# Altium project PCB_MCU.PrjPcb
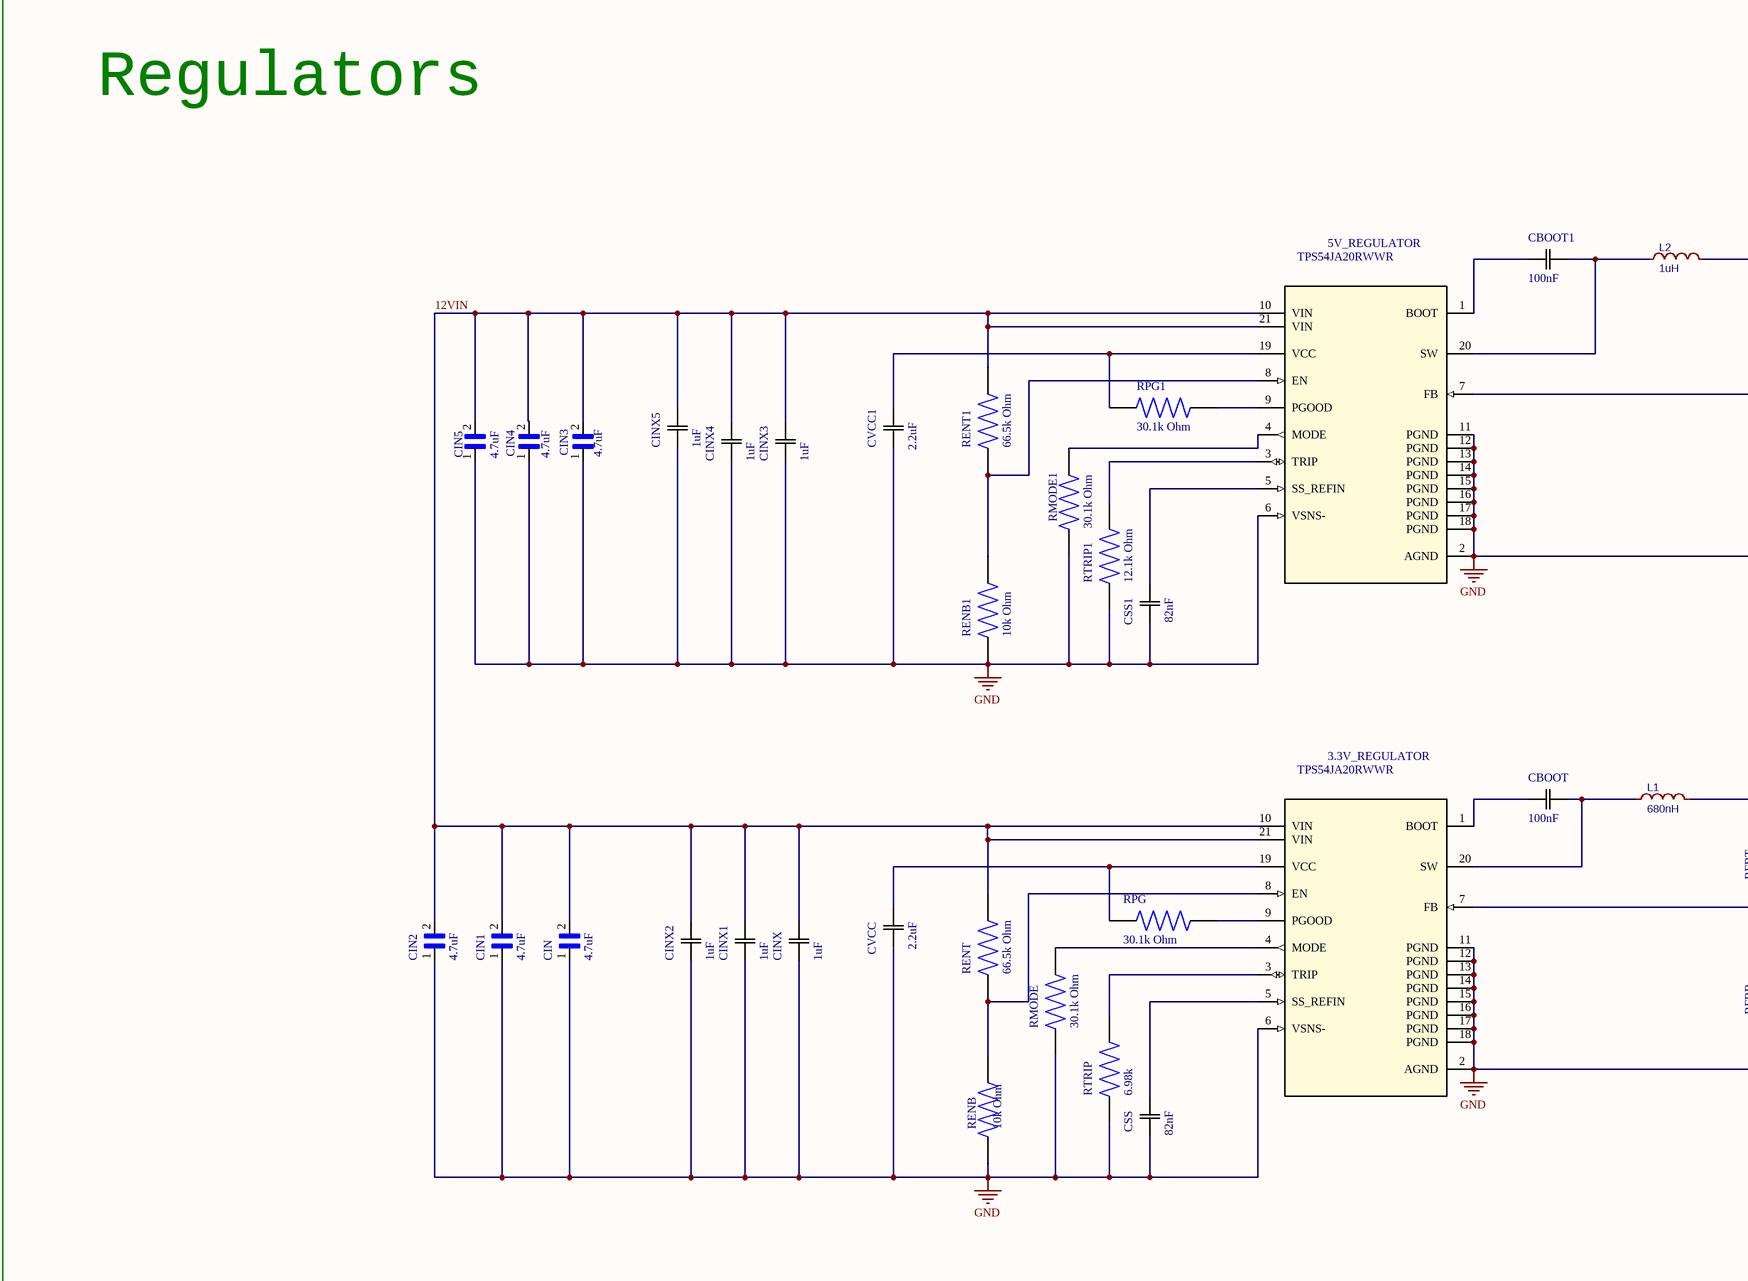
[diagram p0: PCB_MCU.SchDoc, top column 1 of 4]
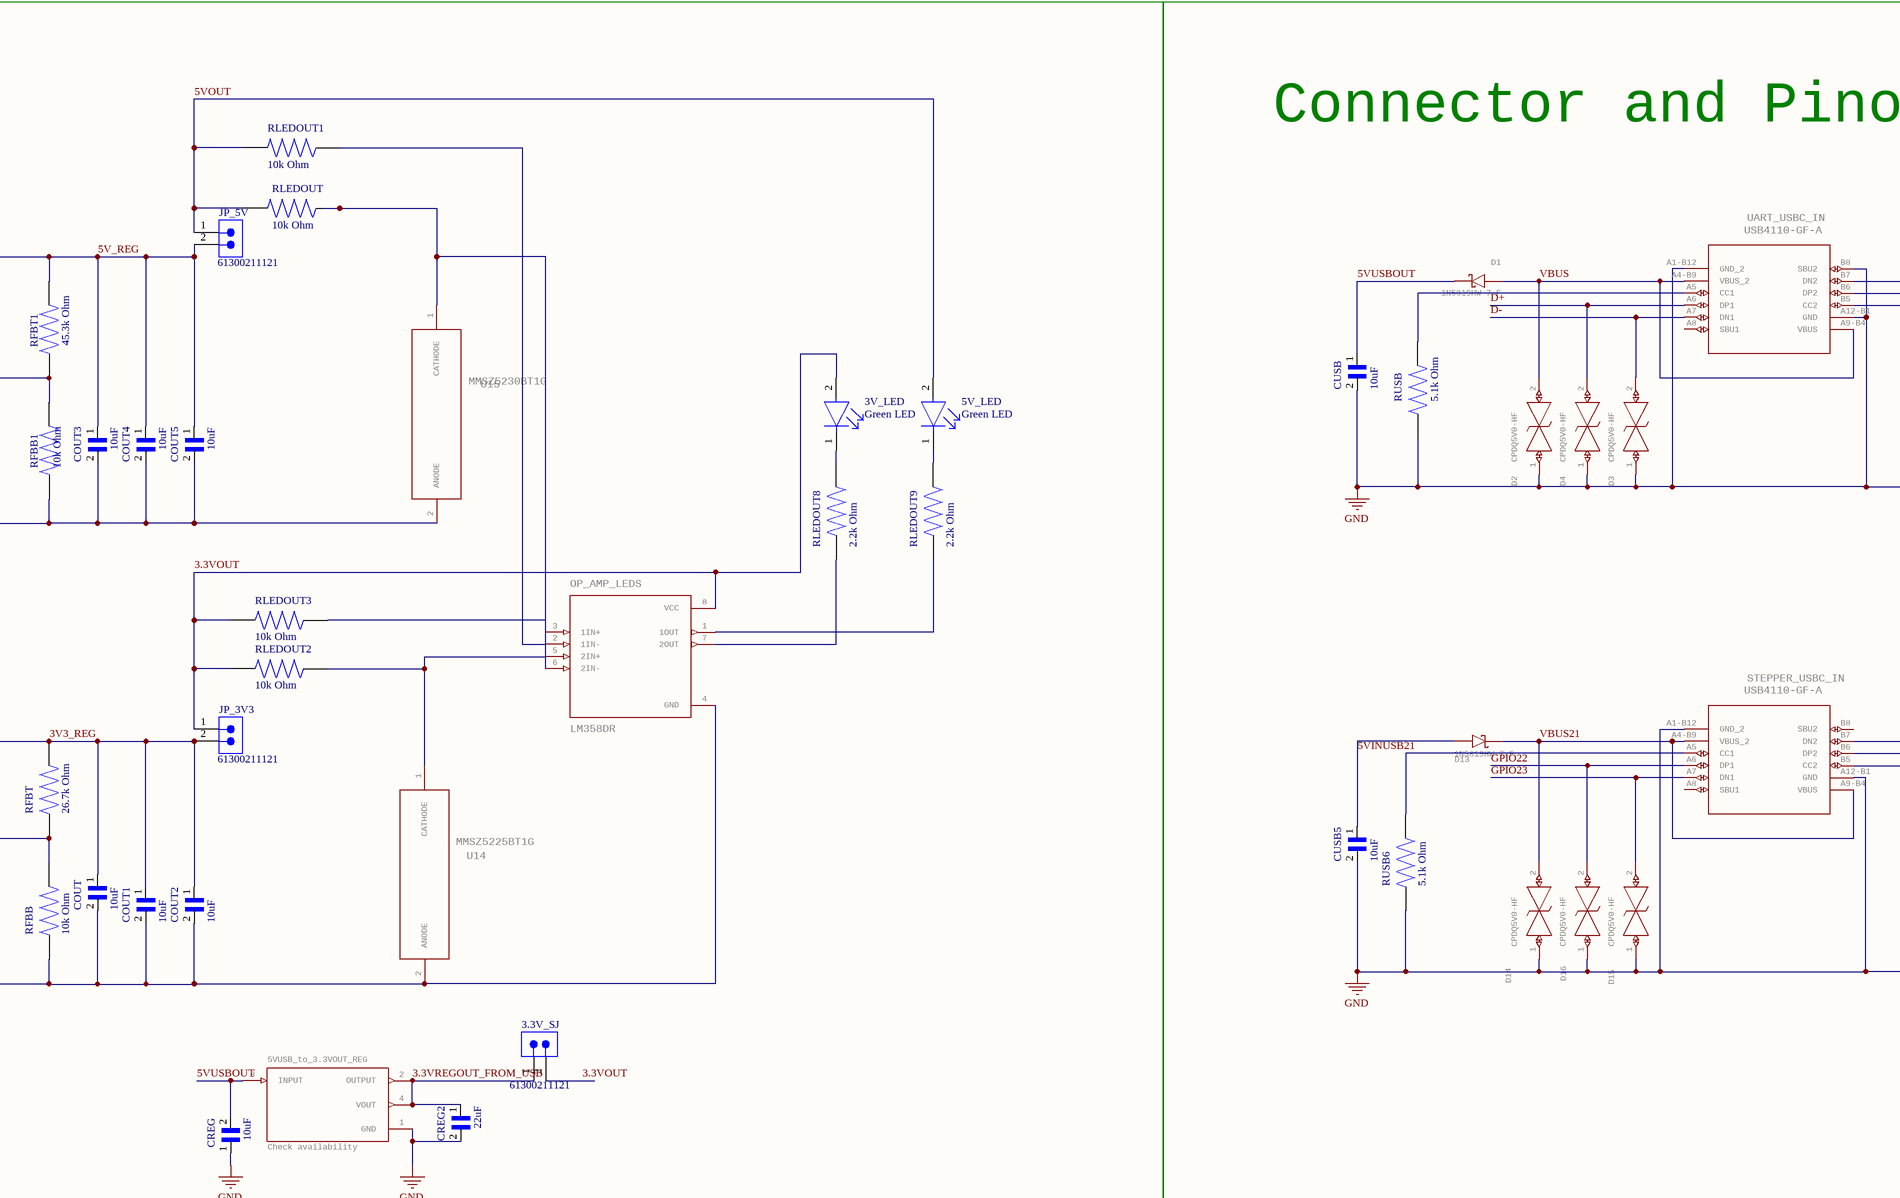
[diagram p1: PCB_MCU.SchDoc, top column 2 of 4]
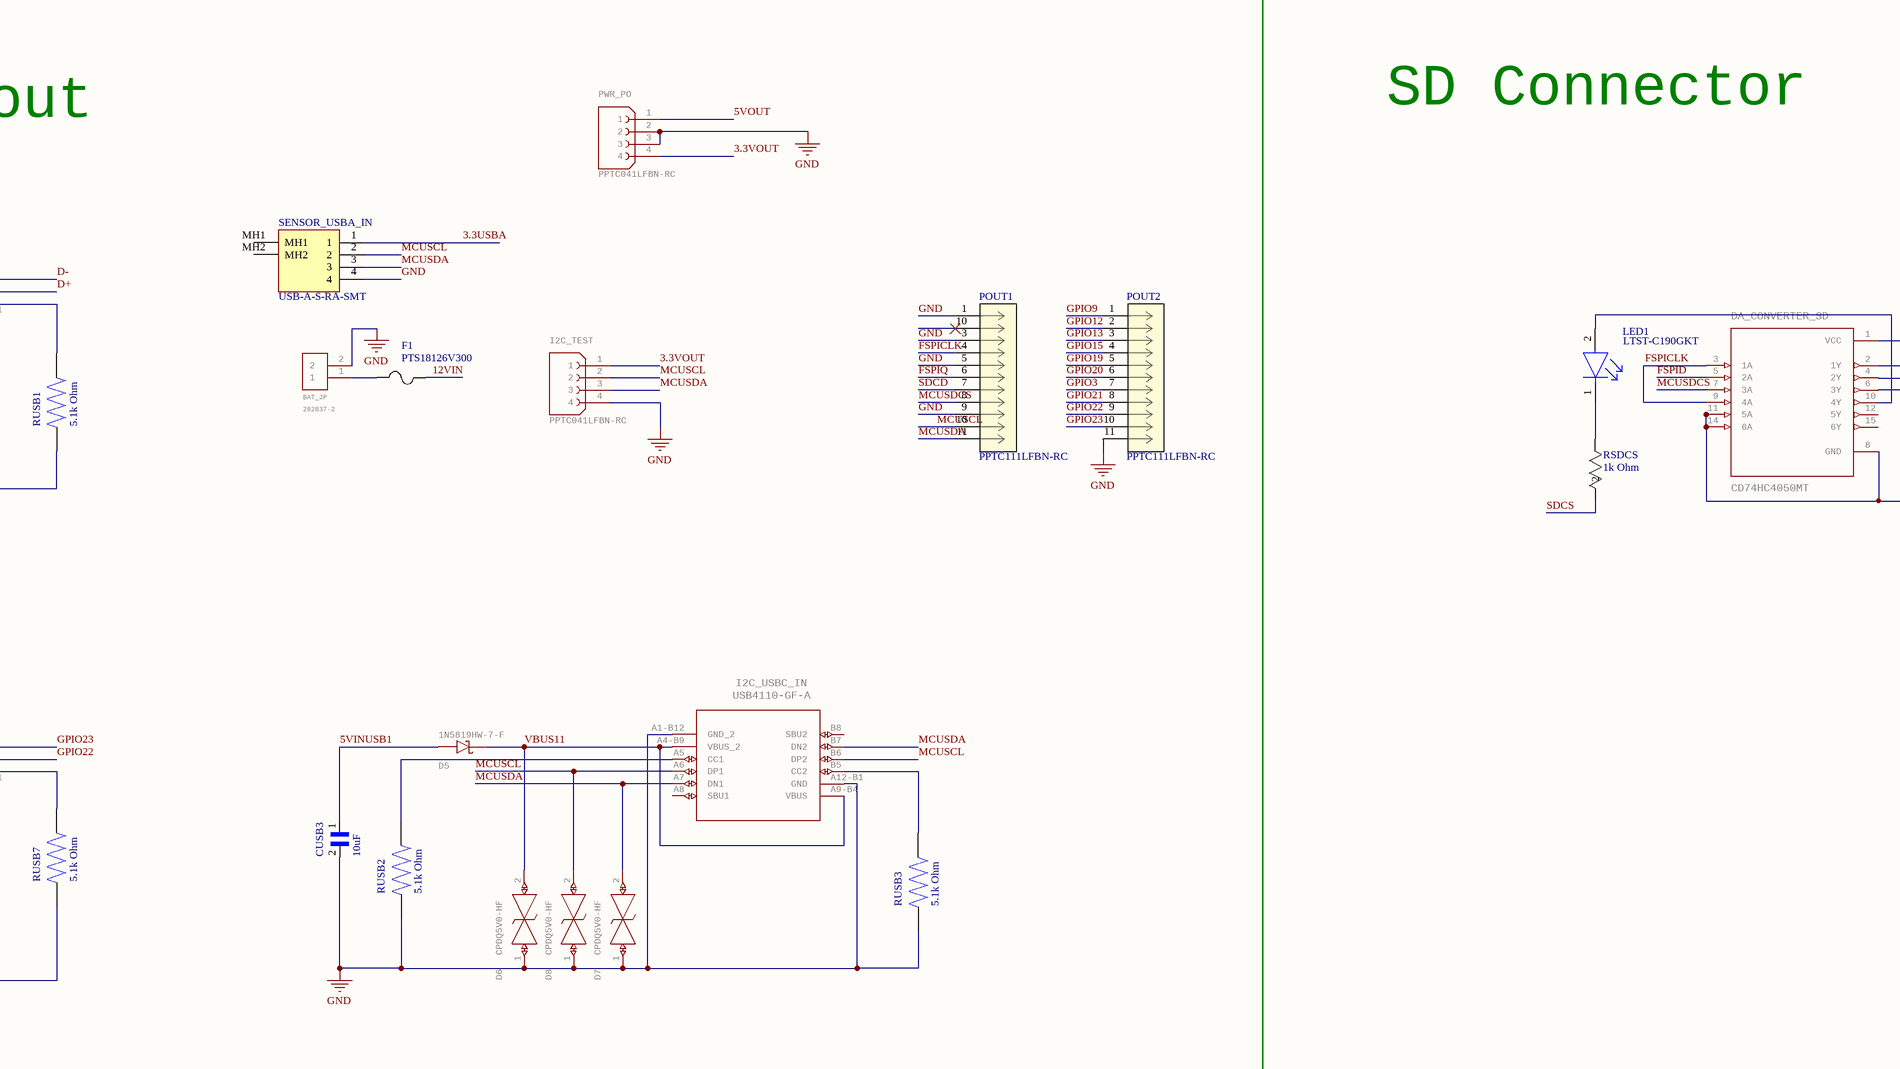
[diagram p2: PCB_MCU.SchDoc, top column 3 of 4]
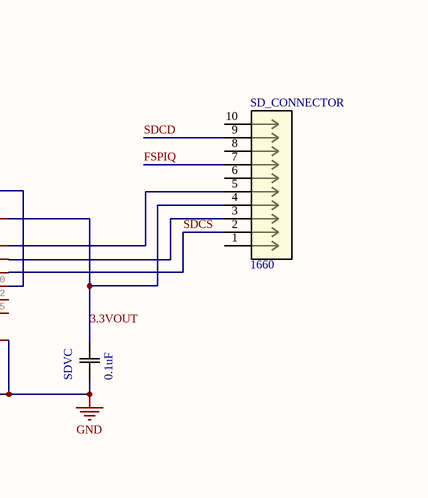
[diagram p3: PCB_MCU.SchDoc, top column 4 of 4]
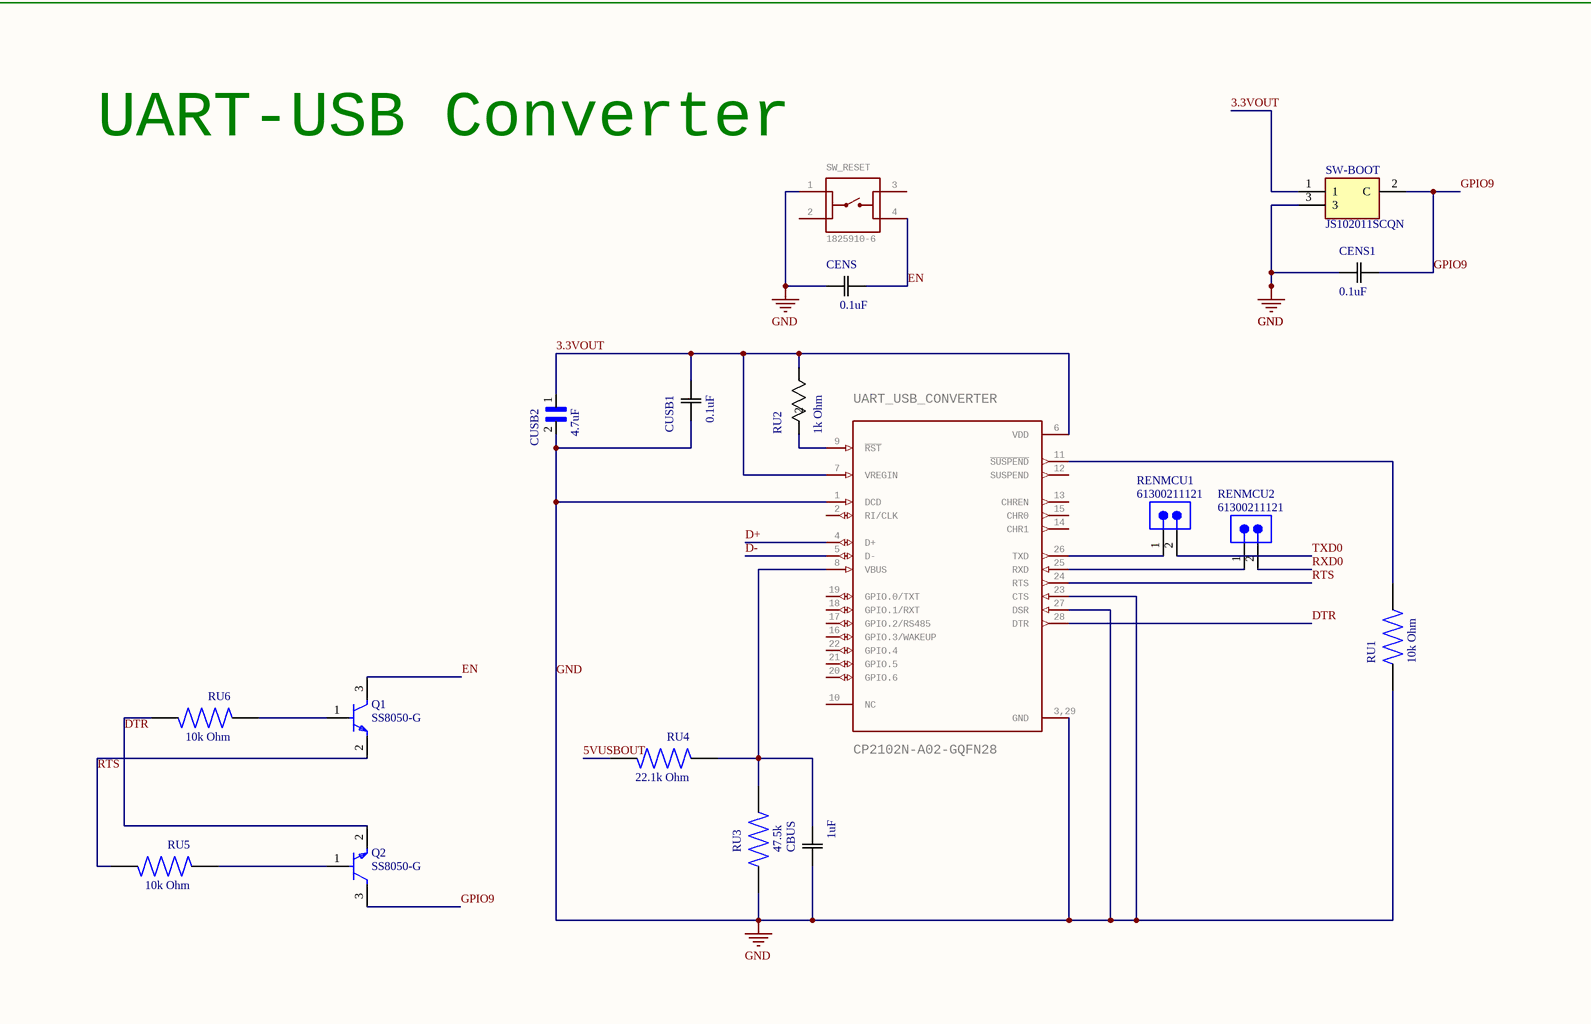
[diagram p4: PCB_MCU.SchDoc, bottom column 1 of 4]
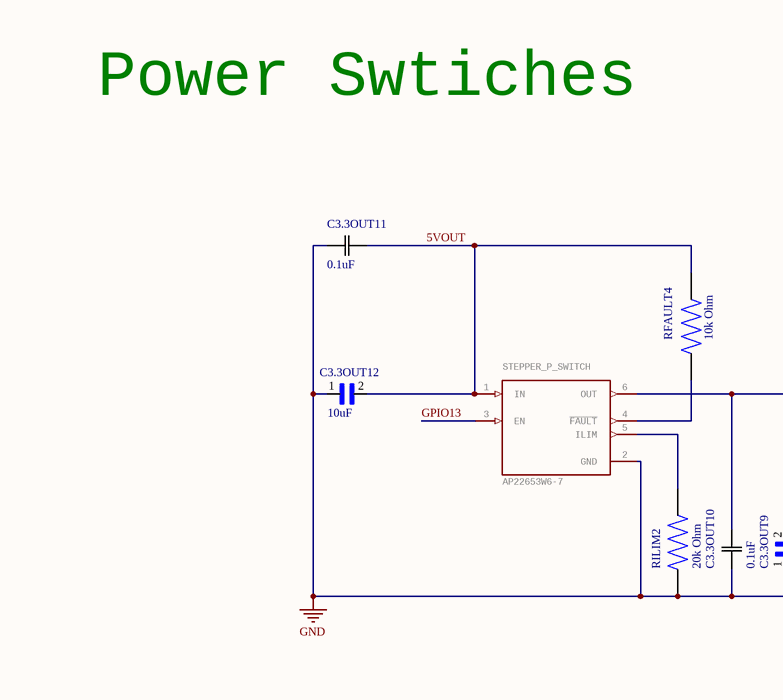
[diagram p5: PCB_MCU.SchDoc, bottom column 2 of 4]
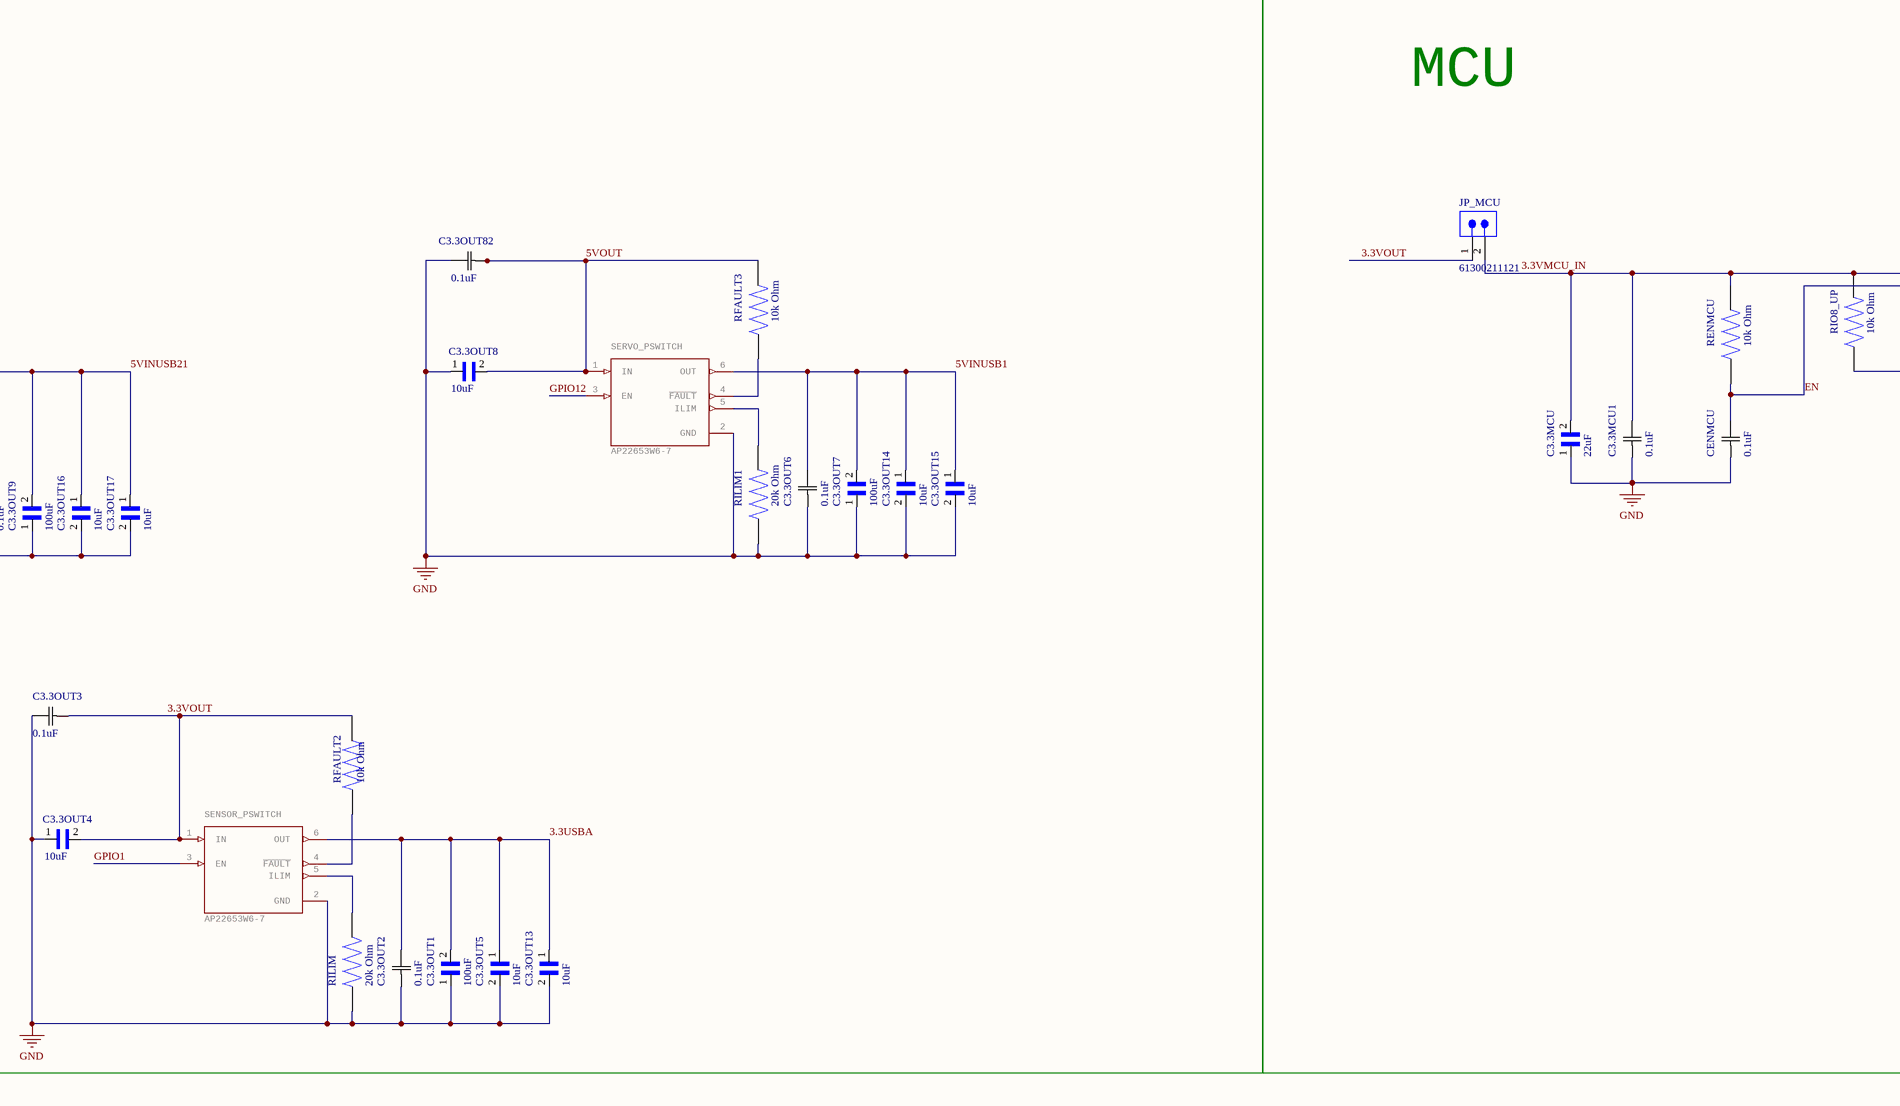
[diagram p6: PCB_MCU.SchDoc, bottom column 3 of 4]
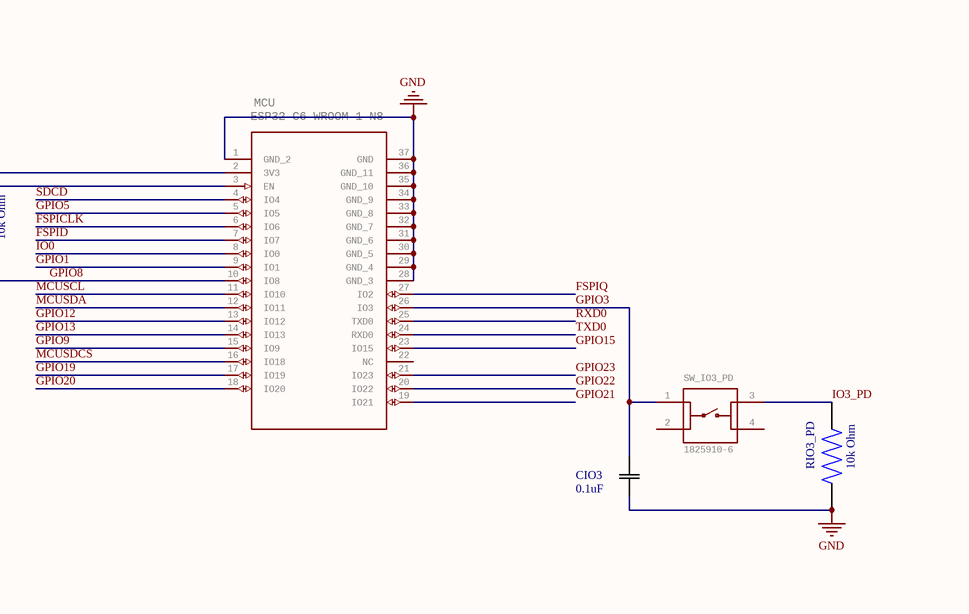
[diagram p7: PCB_MCU.SchDoc, bottom column 4 of 4]
1 sheet, 150 parts. Net scope: global (net labels, ports and power ports of the same name join across sheets).
Board file: PCB_MCU.PcbDoc

## Sheet PCB_MCU.SchDoc
size 1424 x 515 mm; Origin: Eagle

### Parts
3.3V_REGULATOR  TPS54JA20RWWR  [RWW0021A]
3.3V_SJ  61300211121  [61300211121]
3V_LED  Green LED  [FP-LTST-C190GKT-MFG]
5V_LED  Green LED  [FP-LTST-C190GKT-MFG]
5V_REGULATOR  TPS54JA20RWWR  [RWW0021A]
5VUSB_to_3.3VOUT_REG  Check availability  [SOT230P700X185-4N]
BAT_JP  282837-2  [TE_282837-2]
C3.3MCU  22uF  [CAPC2012X145N]
C3.3MCU1  0.1uF  [CAP_KGM21_KAV]
C3.3OUT1  100uF  [CAPC2012X145N]
C3.3OUT2  0.1uF  [CAP_KGM21_KAV]
C3.3OUT3  0.1uF  [CAP_KGM21_KAV]
C3.3OUT4  10uF  [CAPC2012X88N]
C3.3OUT5  10uF  [CAPC2012X88N]
C3.3OUT6  0.1uF  [CAP_KGM21_KAV]
C3.3OUT7  100uF  [CAPC2012X145N]
C3.3OUT8  10uF  [CAPC2012X88N]
C3.3OUT9  100uF  [CAPC2012X145N]
C3.3OUT10  0.1uF  [CAP_KGM21_KAV]
C3.3OUT11  0.1uF  [CAP_KGM21_KAV]
C3.3OUT12  10uF  [CAPC2012X88N]
C3.3OUT13  10uF  [CAPC2012X88N]
C3.3OUT14  10uF  [CAPC2012X88N]
C3.3OUT15  10uF  [CAPC2012X88N]
C3.3OUT16  10uF  [CAPC2012X88N]
C3.3OUT17  10uF  [CAPC2012X88N]
C3.3OUT82  0.1uF  [CAP_KGM21_KAV]
CBOOT  100nF  [CAPC230155_120N_KEM]
CBOOT1  100nF  [CAPC230155_120N_KEM]
CBUS  1uF  [CAPC230145_140N_KEM]
CENMCU  0.1uF  [CAP_KGM21_KAV]
CENS  0.1uF  [CAP_KGM21_KAV]
CENS1  0.1uF  [CAP_KGM21_KAV]
CIN  4.7uF  [CAPC2012X140N]
CIN1  4.7uF  [CAPC2012X140N]
CIN2  4.7uF  [CAPC2012X140N]
CIN3  4.7uF  [CAPC2012X140N]
CIN4  4.7uF  [CAPC2012X140N]
CIN5  4.7uF  [CAPC2012X140N]
CINX  1uF  [CAPC230145_140N_KEM]
CINX1  1uF  [CAPC230145_140N_KEM]
CINX2  1uF  [CAPC230145_140N_KEM]
CINX3  1uF  [CAPC230145_140N_KEM]
CINX4  1uF  [CAPC230145_140N_KEM]
CINX5  1uF  [CAPC230145_140N_KEM]
CIO3  0.1uF  [CAP_KGM21_KAV]
COUT  10uF  [CAPC2012X88N]
COUT1  10uF  [CAPC2012X88N]
COUT2  10uF  [CAPC2012X88N]
COUT3  10uF  [CAPC2012X88N]
COUT4  10uF  [CAPC2012X88N]
COUT5  10uF  [CAPC2012X88N]
CREG  10uF  [CAPC2012X88N]
CREG2  22uF  [CAPC2012X145N]
CSS  82nF  [CAP_CC0805_YAG]
CSS1  82nF  [CAP_CC0805_YAG]
CUSB  10uF  [CAPC2012X88N]
CUSB1  0.1uF  [CAP_KGM21_KAV]
CUSB2  4.7uF  [CAPC2012X140N]
CUSB3  10uF  [CAPC2012X88N]
CUSB5  10uF  [CAPC2012X88N]
CVCC  2.2uF  [CAPC220145_140N_KEM]
CVCC1  2.2uF  [CAPC220145_140N_KEM]
D1  1N5819HW-7-F  [SOD3715X145N]
D2  CPDQ5V0-HF  [MBTB-D-SOD-923F-IMP-0402]
D3  CPDQ5V0-HF  [MBTB-D-SOD-923F-IMP-0402]
D4  CPDQ5V0-HF  [MBTB-D-SOD-923F-IMP-0402]
D5  1N5819HW-7-F  [SOD3715X145N]
D6  CPDQ5V0-HF  [MBTB-D-SOD-923F-IMP-0402]
D7  CPDQ5V0-HF  [MBTB-D-SOD-923F-IMP-0402]
D8  CPDQ5V0-HF  [MBTB-D-SOD-923F-IMP-0402]
D13  1N5819HW-7-F  [SOD3715X145N]
D14  CPDQ5V0-HF  [MBTB-D-SOD-923F-IMP-0402]
D15  CPDQ5V0-HF  [MBTB-D-SOD-923F-IMP-0402]
D16  CPDQ5V0-HF  [MBTB-D-SOD-923F-IMP-0402]
DA_CONVERTER_SD  CD74HC4050MT  [SOIC127P600X175-16N]
F1  PTS18126V300  [FUSE_PTS18126_COB]
I2C_TEST  PPTC041LFBN-RC  [SULLINS_PPTC041LFBN-RC]
I2C_USBC_IN  USB4110-GF-A  [USB4110-GF-A_GCT]
JP_3V3  61300211121  [61300211121]
JP_5V  61300211121  [61300211121]
JP_MCU  61300211121  [61300211121]
L1  680nH  [IND-SMD_L11.3-W10.2_HPPC10024]
L2  1uH  [IND-SMD_L14.5-W13.5]
LED1  LTST-C190GKT  [FP-LTST-C190GKT-MFG]
MCU  ESP32-C6-WROOM-1-N8  [MOD28_ESP32-C6-WROOM-1_EXP]
OP_AMP_LEDS  LM358DR  [SOIC127P599X175-8N]
POUT1  PPTC111LFBN-RC  [CONN11_PPPN111_SUL]
POUT2  PPTC111LFBN-RC  [CONN11_PPPN111_SUL]
PWR_PO  PPTC041LFBN-RC  [SULLINS_PPTC041LFBN-RC]
Q1  SS8050-G  [FP-SS8050-G-MFG]
Q2  SS8050-G  [FP-SS8050-G-MFG]
RENB  10k Ohm  [RESC2012X55N]
RENB1  10k Ohm  [RESC2012X55N]
RENMCU  10k Ohm  [RESC2012X55N]
RENMCU1  61300211121  [61300211121]
RENMCU2  61300211121  [61300211121]
RENT  66.5k Ohm  [RESC2012X60N]
RENT1  66.5k Ohm  [RESC2012X60N]
RFAULT2  10k Ohm  [RESC2012X55N]
RFAULT3  10k Ohm  [RESC2012X55N]
RFAULT4  10k Ohm  [RESC2012X55N]
RFBB  10k Ohm  [RESC2012X55N]
RFBB1  10k Ohm  [RESC2012X55N]
RFBT  26.7k Ohm  [RESC2012X50N]
RFBT1  45.3k Ohm  [RESC2012X50N]
RILIM  20k Ohm  [RESC2012X50N]
RILIM1  20k Ohm  [RESC2012X50N]
RILIM2  20k Ohm  [RESC2012X50N]
RIO3_PD  10k Ohm  [RESC2012X55N]
RIO8_UP  10k Ohm  [RESC2012X55N]
RLEDOUT  10k Ohm  [RESC2012X55N]
RLEDOUT1  10k Ohm  [RESC2012X55N]
RLEDOUT2  10k Ohm  [RESC2012X55N]
RLEDOUT3  10k Ohm  [RESC2012X55N]
RLEDOUT8  2.2k Ohm  [RESC2012X60N]
RLEDOUT9  2.2k Ohm  [RESC2012X60N]
RMODE  30.1k Ohm  [RESC2012X50N]
RMODE1  30.1k Ohm  [RESC2012X50N]
RPG  30.1k Ohm  [RESC2012X50N]
RPG1  30.1k Ohm  [RESC2012X50N]
RSDCS  1k Ohm  [RC0805N_VIS]
RTRIP  6.98k  [RESC2012X50N]
RTRIP1  12.1k Ohm  [RESC1220X65N]
RU1  10k Ohm  [RESC2012X55N]
RU2  1k Ohm  [RC0805N_VIS]
RU3  47.5k  [RESC2012X50N]
RU4  22.1k Ohm  [RESC2012X60N]
RU5  10k Ohm  [RESC2012X55N]
RU6  10k Ohm  [RESC2012X55N]
RUSB  5.1k Ohm  [RESC2012X60N]
RUSB1  5.1k Ohm  [RESC2012X60N]
RUSB2  5.1k Ohm  [RESC2012X60N]
RUSB3  5.1k Ohm  [RESC2012X60N]
RUSB6  5.1k Ohm  [RESC2012X60N]
RUSB7  5.1k Ohm  [RESC2012X60N]
SD_CONNECTOR  1660  [CONN_1660_ADA]
SDVC  0.1uF  [CAP_KGM21_KAV]
SENSOR_PSWITCH  AP22653W6-7  [SOT95P280X145-6N]
SENSOR_USBA_IN  USB-A-S-RA-SMT  [USBASRASMT]
SERVO_PSWITCH  AP22653W6-7  [SOT95P280X145-6N]
STEPPER_P_SWITCH  AP22653W6-7  [SOT95P280X145-6N]
STEPPER_USBC_IN  USB4110-GF-A  [USB4110-GF-A_GCT]
SW-BOOT  JS102011SCQN  [JS102011SCQN]
SW_IO3_PD  1825910-6  [SW_1825910-6-4]
SW_RESET  1825910-6  [SW_1825910-6-4]
U14  MMSZ5225BT1G  [SOD-123_ONS]
U15  MMSZ5230BT1G  [SOD-123_ONS]
UART_USB_CONVERTER  CP2102N-A02-GQFN28  [QFN50P500X500X80-29N]
UART_USBC_IN  USB4110-GF-A  [USB4110-GF-A_GCT]

### Blocks framed on the sheet
Regulators: 3.3V_REGULATOR 3.3V_SJ 3V_LED 5V_LED 5V_REGULATOR 5VUSB_to_3.3VOUT_REG CBOOT CBOOT1 CIN CIN1-CIN5 CINX CINX1-CINX5 COUT COUT1-COUT5 CREG CREG2 CSS CSS1 CVCC CVCC1 JP_3V3 JP_5V L1 L2 OP_AMP_LEDS RENB RENB1 RENT RENT1 RFBB RFBB1 RFBT RFBT1 RLEDOUT RLEDOUT1-RLEDOUT3 RLEDOUT8 RLEDOUT9 RMODE RMODE1 RPG RPG1 RTRIP RTRIP1 U14 U15
Connector and Pinout: BAT_JP CUSB CUSB3 CUSB5 D1-D8 D13-D16 F1 I2C_TEST I2C_USBC_IN POUT1 POUT2 PWR_PO RUSB RUSB1-RUSB3 RUSB6 RUSB7 SENSOR_USBA_IN STEPPER_USBC_IN UART_USBC_IN
SD Connector: DA_CONVERTER_SD LED1 RSDCS SD_CONNECTOR SDVC
UART-USB Converter: CBUS CENS CENS1 CUSB1 CUSB2 Q1 Q2 RENMCU1 RENMCU2 RU1-RU6 SW-BOOT SW_RESET UART_USB_CONVERTER
Power Swtiches: C3.3OUT1-C3.3OUT17 C3.3OUT82 RFAULT2-RFAULT4 RILIM RILIM1 RILIM2 SENSOR_PSWITCH SERVO_PSWITCH STEPPER_P_SWITCH
MCU: C3.3MCU C3.3MCU1 CENMCU CIO3 JP_MCU MCU RENMCU RIO3_PD RIO8_UP SW_IO3_PD

### Nets
GND: 3.3V_REGULATOR.2(AGND) 3.3V_REGULATOR.6(VSNS-) 3.3V_REGULATOR.11(PGND) 3.3V_REGULATOR.12(PGND) 3.3V_REGULATOR.13(PGND) 3.3V_REGULATOR.14(PGND) 3.3V_REGULATOR.15(PGND) 3.3V_REGULATOR.16(PGND) 3.3V_REGULATOR.17(PGND) 3.3V_REGULATOR.18(PGND) 5V_REGULATOR.2(AGND) 5V_REGULATOR.6(VSNS-) 5V_REGULATOR.11(PGND) 5V_REGULATOR.12(PGND) 5V_REGULATOR.13(PGND) 5V_REGULATOR.14(PGND) 5V_REGULATOR.15(PGND) 5V_REGULATOR.16(PGND) 5V_REGULATOR.17(PGND) 5V_REGULATOR.18(PGND) 5VUSB_to_3.3VOUT_REG.1(GND) BAT_JP.2 C3.3MCU.1 C3.3MCU1.1 C3.3OUT1.1 C3.3OUT2.1 C3.3OUT3.2 C3.3OUT4.1 C3.3OUT5.2 C3.3OUT6.1 C3.3OUT7.1 C3.3OUT8.1 C3.3OUT9.1 C3.3OUT10.1 C3.3OUT11.1 C3.3OUT12.1 C3.3OUT13.2 C3.3OUT14.2 C3.3OUT15.2 C3.3OUT16.2 C3.3OUT17.2 C3.3OUT82.2 CBUS.1 CENMCU.1 CENS.1 CENS1.1 CIN.1 CIN1.1 CIN2.1 CIN3.1 CIN4.1 CIN5.1 CINX.1 CINX1.1 CINX2.1 CINX3.1 CINX4.1 CINX5.1 CIO3.1 COUT.2 COUT1.2 COUT2.2 COUT3.2 COUT4.2 COUT5.2 CREG.1 CREG2.2 CSS.2 CSS1.2 CUSB.2 CUSB1.2 CUSB2.2 CUSB3.2 CUSB5.2 CVCC.2 CVCC1.2 D2.1(K) D3.1(K) D4.1(K) D6.1(K) D7.1(K) D8.1(K) D14.1(K) D15.1(K) D16.1(K) DA_CONVERTER_SD.8(GND) DA_CONVERTER_SD.11(5A) DA_CONVERTER_SD.14(6A) I2C_TEST.4 I2C_USBC_IN.A1-B12(GND_2) I2C_USBC_IN.A12-B1(GND) MCU.1(GND_2) MCU.28(GND_3) MCU.29(GND_4) MCU.30(GND_5) MCU.31(GND_6) MCU.32(GND_7) MCU.33(GND_8) MCU.34(GND_9) MCU.35(GND_10) MCU.36(GND_11) MCU.37(GND) OP_AMP_LEDS.4(GND) POUT1.1 POUT1.3 POUT1.5 POUT1.9 POUT2.11 PWR_PO.2 PWR_PO.3 RENB.1 RENB1.1 RFBB.1 RFBB1.1 RILIM.1 RILIM1.1 RILIM2.1 RIO3_PD.1 RMODE.1 RMODE1.1 RTRIP.1 RTRIP1.1 RU1.1 RU3.1 RUSB.1 RUSB1.2 RUSB2.2 RUSB3.2 RUSB6.2 RUSB7.2 SDVC.1 SENSOR_PSWITCH.2(GND) SENSOR_USBA_IN.4 SERVO_PSWITCH.2(GND) STEPPER_P_SWITCH.2(GND) STEPPER_USBC_IN.A1-B12(GND_2) STEPPER_USBC_IN.A12-B1(GND) SW-BOOT.3 SW_RESET.1 U14.2(ANODE) U15.2(ANODE) UART_USB_CONVERTER.1(DCD) UART_USB_CONVERTER.3,29(GND) UART_USB_CONVERTER.23(CTS) UART_USB_CONVERTER.27(DSR) UART_USBC_IN.A1-B12(GND_2) UART_USBC_IN.A12-B1(GND) UART_USBC_IN.B8(SBU2)
3.3USBA: C3.3OUT1.2 C3.3OUT2.2 C3.3OUT5.1 C3.3OUT13.1 SENSOR_PSWITCH.6(OUT) SENSOR_USBA_IN.1
3.3VMCU_IN: C3.3MCU.2 C3.3MCU1.2 JP_MCU.2 MCU.2(3V3) RENMCU.2 RIO8_UP.2
3.3VOUT: 3.3V_SJ.2 3V_LED.2(A) C3.3OUT3.1 C3.3OUT4.2 CUSB1.1 CUSB2.1 DA_CONVERTER_SD.1(VCC) I2C_TEST.1 JP_3V3.1 JP_MCU.1 OP_AMP_LEDS.8(VCC) PWR_PO.4 RFAULT2.2 RLEDOUT2.2 RLEDOUT3.2 RU2.1 SD_CONNECTOR.4 SDVC.2 SENSOR_PSWITCH.1(IN) SW-BOOT.1 UART_USB_CONVERTER.6(VDD) UART_USB_CONVERTER.7(VREGIN)
3.3VREGOUT_FROM_USB: 3.3V_SJ.1 5VUSB_to_3.3VOUT_REG.2(OUTPUT) 5VUSB_to_3.3VOUT_REG.4(VOUT) CREG2.1
3V3_REG: COUT.1 COUT1.1 COUT2.1 JP_3V3.2 L1.2 RFBT.2
5V_REG: COUT3.1 COUT4.1 COUT5.1 JP_5V.2 L2.2 RFBT1.2
5VINUSB1: C3.3OUT6.2 C3.3OUT7.2 C3.3OUT14.1 C3.3OUT15.1 CUSB3.1 D5.A SERVO_PSWITCH.6(OUT)
5VINUSB21: C3.3OUT9.2 C3.3OUT10.2 C3.3OUT16.1 C3.3OUT17.1 CUSB5.1 D13.A STEPPER_P_SWITCH.6(OUT)
5VOUT: 5V_LED.2(A) C3.3OUT8.2 C3.3OUT11.2 C3.3OUT12.2 C3.3OUT82.1 JP_5V.1 PWR_PO.1 RFAULT3.2 RFAULT4.2 RLEDOUT.2 RLEDOUT1.2 SERVO_PSWITCH.1(IN) STEPPER_P_SWITCH.1(IN)
5VUSBOUT: 5VUSB_to_3.3VOUT_REG.3(INPUT) CREG.2 CUSB.1 D1.C(K) RU4.2
12VIN: 3.3V_REGULATOR.10(VIN) 3.3V_REGULATOR.21(VIN) 5V_REGULATOR.10(VIN) 5V_REGULATOR.21(VIN) CIN.2 CIN1.2 CIN2.2 CIN3.2 CIN4.2 CIN5.2 CINX.2 CINX1.2 CINX2.2 CINX3.2 CINX4.2 CINX5.2 F1.2 RENT.2 RENT1.2
D+: D4.2(A) UART_USB_CONVERTER.4(D+) UART_USBC_IN.A6(DP1) UART_USBC_IN.B6(DP2)
D-: D3.2(A) UART_USB_CONVERTER.5(D-) UART_USBC_IN.A7(DN1) UART_USBC_IN.B7(DN2)
DTR: Q2.2(E) RU6.2 UART_USB_CONVERTER.28(DTR)
EN: CENMCU.2 CENS.2 MCU.3(EN) Q1.3(C) RENMCU.1 SW_RESET.4
FSPICLK: DA_CONVERTER_SD.3(1A) DA_CONVERTER_SD.9(4A) MCU.6(IO6) POUT1.4
FSPID: DA_CONVERTER_SD.5(2A) MCU.7(IO7)
FSPIQ: MCU.27(IO2) POUT1.6 SD_CONNECTOR.7
GPIO1: MCU.9(IO1) SENSOR_PSWITCH.3(EN)
GPIO3: CIO3.2 MCU.26(IO3) POUT2.7 SW_IO3_PD.1
GPIO5: MCU.5(IO5)
GPIO8: MCU.10(IO8) RIO8_UP.1
GPIO9: CENS1.2 MCU.15(IO9) POUT2.1 Q2.3(C) SW-BOOT.2(C)
GPIO12: MCU.13(IO12) POUT2.2 SERVO_PSWITCH.3(EN)
GPIO13: MCU.14(IO13) POUT2.3 STEPPER_P_SWITCH.3(EN)
GPIO15: MCU.23(IO15) POUT2.4
GPIO19: MCU.17(IO19) POUT2.5
GPIO20: MCU.18(IO20) POUT2.6
GPIO21: MCU.19(IO21) POUT2.8
GPIO22: D16.2(A) MCU.20(IO22) POUT2.9 STEPPER_USBC_IN.A6(DP1) STEPPER_USBC_IN.B6(DP2)
GPIO23: D15.2(A) MCU.21(IO23) POUT2.10 STEPPER_USBC_IN.A7(DN1) STEPPER_USBC_IN.B7(DN2)
IO0: MCU.8(IO0)
IO3_PD: RIO3_PD.2 SW_IO3_PD.3
MCUSCL: D8.2(A) I2C_TEST.2 I2C_USBC_IN.A6(DP1) I2C_USBC_IN.B6(DP2) MCU.11(IO10) POUT1.10 SENSOR_USBA_IN.2
MCUSDA: D7.2(A) I2C_TEST.3 I2C_USBC_IN.A7(DN1) I2C_USBC_IN.B7(DN2) MCU.12(IO11) POUT1.11 SENSOR_USBA_IN.3
MCUSDCS: DA_CONVERTER_SD.7(3A) MCU.16(IO18) POUT1.8
RTS: Q1.2(E) RU5.2 UART_USB_CONVERTER.24(RTS)
RXD0: MCU.25(TXD0) RENMCU2.2
SDCD: MCU.4(IO4) POUT1.7 SD_CONNECTOR.9
SDCS: DA_CONVERTER_SD.6(3Y) RSDCS.2 SD_CONNECTOR.2
TXD0: MCU.24(RXD0) RENMCU1.2
VBUS: D1.A D2.2(A) UART_USBC_IN.A4-B9(VBUS_2) UART_USBC_IN.A9-B4(VBUS)
VBUS11: D5.C(K) D6.2(A) I2C_USBC_IN.A4-B9(VBUS_2) I2C_USBC_IN.A9-B4(VBUS)
VBUS21: D13.C(K) D14.2(A) STEPPER_USBC_IN.A4-B9(VBUS_2) STEPPER_USBC_IN.A9-B4(VBUS)
Net3.3V_REGULATOR_1: 3.3V_REGULATOR.1(BOOT) CBOOT.1
Net3.3V_REGULATOR_3: 3.3V_REGULATOR.3(TRIP) RTRIP.2
Net3.3V_REGULATOR_4: 3.3V_REGULATOR.4(MODE) RMODE.2
Net3.3V_REGULATOR_5: 3.3V_REGULATOR.5(SS_REFIN) CSS.1
Net3.3V_REGULATOR_7: 3.3V_REGULATOR.7(FB) RFBB.2 RFBT.1
Net3.3V_REGULATOR_8: 3.3V_REGULATOR.8(EN) RENB.2 RENT.1
Net3.3V_REGULATOR_9: 3.3V_REGULATOR.9(PGOOD) RPG.2
Net3.3V_REGULATOR_19: 3.3V_REGULATOR.19(VCC) CVCC.1 RPG.1
Net3.3V_REGULATOR_20: 3.3V_REGULATOR.20(SW) CBOOT.2 L1.1
Net3V_LED_1: 3V_LED.1(C) RLEDOUT8.1
Net5V_LED_1: 5V_LED.1(C) RLEDOUT9.1
Net5V_REGULATOR_1: 5V_REGULATOR.1(BOOT) CBOOT1.1
Net5V_REGULATOR_3: 5V_REGULATOR.3(TRIP) RTRIP1.2
Net5V_REGULATOR_4: 5V_REGULATOR.4(MODE) RMODE1.2
Net5V_REGULATOR_5: 5V_REGULATOR.5(SS_REFIN) CSS1.1
Net5V_REGULATOR_7: 5V_REGULATOR.7(FB) RFBB1.2 RFBT1.1
Net5V_REGULATOR_8: 5V_REGULATOR.8(EN) RENB1.2 RENT1.1
Net5V_REGULATOR_9: 5V_REGULATOR.9(PGOOD) RPG1.2
Net5V_REGULATOR_19: 5V_REGULATOR.19(VCC) CVCC1.1 RPG1.1
Net5V_REGULATOR_20: 5V_REGULATOR.20(SW) CBOOT1.2 L2.1
NetBAT_JP_1: BAT_JP.1 F1.1
NetCBUS_2: CBUS.2 RU3.2 RU4.1 UART_USB_CONVERTER.8(VBUS)
NetDA_CONVERTER_SD_2: DA_CONVERTER_SD.2(1Y) SD_CONNECTOR.5
NetDA_CONVERTER_SD_4: DA_CONVERTER_SD.4(2Y) SD_CONNECTOR.3
NetDA_CONVERTER_SD_10: DA_CONVERTER_SD.10(4Y) LED1.2(A)
NetI2C_USBC_IN_A5: I2C_USBC_IN.A5(CC1) RUSB2.1
NetI2C_USBC_IN_B5: I2C_USBC_IN.B5(CC2) RUSB3.1
NetLED1_1: LED1.1(C) RSDCS.1
NetOP_AMP_LEDS_1: OP_AMP_LEDS.1(1OUT) RLEDOUT9.2
NetOP_AMP_LEDS_2: OP_AMP_LEDS.2(1IN-) RLEDOUT1.1
NetOP_AMP_LEDS_3: OP_AMP_LEDS.3(1IN+) RLEDOUT.1 U15.1(CATHODE)
NetOP_AMP_LEDS_5: OP_AMP_LEDS.5(2IN+) RLEDOUT2.1 U14.1(CATHODE)
NetOP_AMP_LEDS_6: OP_AMP_LEDS.6(2IN-) RLEDOUT3.1
NetOP_AMP_LEDS_7: OP_AMP_LEDS.7(2OUT) RLEDOUT8.2
NetQ1_1: Q1.1(B) RU6.1
NetQ2_1: Q2.1(B) RU5.1
NetRENMCU1_1: RENMCU1.1 UART_USB_CONVERTER.26(TXD)
NetRENMCU2_1: RENMCU2.1 UART_USB_CONVERTER.25(RXD)
NetRFAULT2_1: RFAULT2.1 SENSOR_PSWITCH.4(~{FAULT})
NetRFAULT3_1: RFAULT3.1 SERVO_PSWITCH.4(~{FAULT})
NetRFAULT4_1: RFAULT4.1 STEPPER_P_SWITCH.4(~{FAULT})
NetRILIM1_2: RILIM1.2 SERVO_PSWITCH.5(ILIM)
NetRILIM2_2: RILIM2.2 STEPPER_P_SWITCH.5(ILIM)
NetRILIM_2: RILIM.2 SENSOR_PSWITCH.5(ILIM)
NetRU1_2: RU1.2 UART_USB_CONVERTER.11(~{SUSPEND})
NetRU2_2: RU2.2 UART_USB_CONVERTER.9(~{RST})
NetRUSB1_1: RUSB1.1 UART_USBC_IN.B5(CC2)
NetRUSB6_1: RUSB6.1 STEPPER_USBC_IN.A5(CC1)
NetRUSB7_1: RUSB7.1 STEPPER_USBC_IN.B5(CC2)
NetRUSB_2: RUSB.2 UART_USBC_IN.A5(CC1)

Not connected (* = marked no-connect by the designer): DA_CONVERTER_SD 12(5Y) 15(6Y); I2C_USBC_IN A8(SBU1) B8(SBU2); MCU 22(NC); SD_CONNECTOR 1 6 8 10; SENSOR_USBA_IN MH1 MH2; STEPPER_USBC_IN A8(SBU1) B8(SBU2); SW_IO3_PD 2 4; SW_RESET 2 3; UART_USB_CONVERTER 2(RI/CLK) 10(NC) 12(SUSPEND) 13(CHREN) 14(CHR1) 15(CHR0) 16(GPIO.3/WAKEUP) 17(GPIO.2/RS485) 18(GPIO.1/RXT) 19(GPIO.0/TXT) 20(GPIO.6) 21(GPIO.5) 22(GPIO.4); UART_USBC_IN A8(SBU1)

### Library data of the parts
3.3V_REGULATOR 5V_REGULATOR = TPS54JA20RWWR: No Description Available; Mfr_Name: Texas Instruments; Manufacturer_Part_Number: TPS54JA20RWWR; Type: DEV; RefDes: RefDes; Copyright: Copyright (C) 2023 Ultra Librarian. All rights reserved.
3.3V_SJ JP_3V3 JP_5V JP_MCU RENMCU1 RENMCU2 = CMP-1712-00002-5: NexarPartId: 20081794; Operating Supply Voltage: 250V; Current Rating: 3A; Gender: Male; Number of Contacts: 2; Pitch: 2.54mm; Connector Type: Male Pin; Contact Resistance: 20mΩ; Contact Plating: Gold; Contact Material: Copper; Number of Pins: 2; Min Operating Temperature: -40°C; Packaging: Bulk; Lead Pitch: 2.54mm; Mount: Through Hole; Orientation: Vertical; RoHS: Compliant; REACH SVHC: No SVHC; Height: 8.94mm; Termination: Through Hole; Number of Positions: 2; Contact Mating Length: 5.9944mm; Color: Black; Contact Gender: Male; Number of Rows: 1; Housing Material: PBT; Lead Free: Lead Free; Voltage Rating: 250V; Max Operating Temperature: 125°C
3V_LED 5V_LED LED1 = CMP-22017-000005-2: LED GREEN CLEAR CHIP SMD; Dominant Wavelength: 569nm; Reverse Voltage: 5V; Lens Color: Colorless; Viewing Angle: 130°; Voltage: 2V; Forward Current: 30mA; Power Dissipation: 100mW; Luminous Intensity: 6mcd; Number of LEDs: 1; Forward Voltage: 2.1V; Wavelength: 565nm; Test Current: 10mA; Min Operating Temperature: -55°C; Lens Style: Clear; Mount: Surface Mount; Width: 0.8mm; Packaging: Tape and Reel; Lens Transparency: Clear; Case Code (Metric): 1608; Depth: 0.8mm; Case Code (Imperial): 0603; Case/Package: 0603; Number of Pins: 2; Max Operating Temperature: 85°C; Lead Free: Lead Free; Number of Elements: 1; Length: 1.6mm; Height: 0.8mm; Package Quantity: 1; Power Rating: 100mW; Radiation Hardening: No; Illumination Color: Green; Color: Green
5VUSB_to_3.3VOUT_REG = AZ1117IH-3.3TRG1: GateName_1: G$1; MF: Diodes Inc.; SymbolName_1: AZ1117IH-3.3TRG1; LibraryName: AZ1117IH-3.3TRG1; DeviceSetName: AZ1117IH-3.3TRG1; Package: SOT-223 Diodes Inc.; Price: None; Check_prices: https://www.snapeda.com/parts/AZ1117IH-3.3TRG1/Diodes+Inc./view-part/?ref=eda; SnapEDA_Link: https://www.snapeda.com/parts/AZ1117IH-3.3TRG1/Diodes+Inc./view-part/?ref=snap; MP: AZ1117IH-3.3TRG1; Availability: In Stock; Purchase-URL: https://www.snapeda.com/api/url_track_click_mouser/?unipart_id=490259&manufacturer=Diodes Inc.&part_name=AZ1117IH-3.3TRG1&search_term=az1117ih-3.3trg1
BAT_JP = 282837-2: TERM BLOCK 5.08MM 2POS SIDE ENTY Check availability; GateName_1: G$1; MF: TE Connectivity; SymbolName_1: 282837-2; LibraryName: Terminal_Block2P; DeviceSetName: 282837-2; AVAILABILITY: In Stock; CHECK_PRICES: https://www.snapeda.com/parts/282837-2/TE+Connectivity+AMP+Connectors/view-part/?ref=eda; MP: 282837-2; PACKAGE: None; PRICE: None; PURCHASE-URL: https://pricing.snapeda.com/search?q=282837-2&ref=eda; SNAPEDA_LINK: https://www.snapeda.com/parts/282837-2/TE+Connectivity+AMP+Connectors/view-part/?ref=snap
C3.3MCU CREG2 = GRM21BR61C226ME44L: SMD Capacitor X5R(EIA) with Capacitance: 22uF Tol. 20%. Rated Voltage: 16Vdc; MF: Murata; Arrow_Electronics-Purchase-URL: https://snapeda.com/shop?store=Arrow+Electronics&id=4387753; Value: *; Package: 2012 Murata; MP: GRM21BR61C226ME44L; DigiKey-Purchase-URL: https://snapeda.com/shop?store=DigiKey&id=4387753; Mouser-Purchase-URL: https://snapeda.com/shop?store=Mouser&id=4387753; SnapEDA_Link: https://www.snapeda.com/parts/GRM21BR61C226ME44L/Murata/view-part/4387753/?ref=snap; Digi-Key_Part_Number: 490-10747-1-ND
C3.3MCU1 C3.3OUT2 C3.3OUT3 C3.3OUT6 C3.3OUT10 C3.3OUT11 C3.3OUT82 = KGM21NR71H104JT: No Description Available; Mfr_Name: KYOCERA AVX; Type: DEV; Copyright: Copyright (C) 2023 Ultra Librarian. All rights reserved.; Manufacturer_Part_Number: KGM21NR71H104JT; RefDes: RefDes
C3.3OUT1 C3.3OUT7 C3.3OUT9 = GRM21BC80G107ME15L: 100ÂµF Â±20% 4V Ceramic Capacitor X6S 0805 (2012 Metric); MF: Murata Electronics; Package: 2012 Murata; Price: None; Check_prices: https://www.snapeda.com/parts/GRM21BC80G107ME15L/Murata+Electronics+North+America/view-part/?ref=eda; Value: *; SnapEDA_Link: https://www.snapeda.com/parts/GRM21BC80G107ME15L/Murata+Electronics+North+America/view-part/?ref=snap; MP: GRM21BC80G107ME15L; Availability: In Stock; Purchase-URL: https://pricing.snapeda.com/search?q=GRM21BC80G107ME15L&ref=eda
C3.3OUT4 C3.3OUT5 C3.3OUT8 C3.3OUT12-C3.3OUT17 COUT COUT1-COUT5 CREG CUSB CUSB3 CUSB5 = C0805C106J8RACAUTO: 10ÂµF Â±5% 10V Ceramic Capacitor X7R 0805 _2012 Metric_; MF: KEMET; Price: None; SnapEDA_Link: https://www.snapeda.com/parts/C0805C106J8RACAUTO/KEMET/view-part/3596814/?ref=snap; MP: C0805C106J8RACAUTO; Availability: Unavailable; Value: *; Package: 0805 KEMET
CBOOT CBOOT1 = C0805X104K5RAC3316: No Description Available; Mfr_Name: Kemet; Copyright: Copyright (C) 2023 Ultra Librarian. All rights reserved.; Manufacturer_Part_Number: C0805X104K5RAC3316; RefDes: RefDes; Type: DEV
CBUS CINX CINX1-CINX5 = C0805C105K3RACAUTO: No Description Available; Mfr_Name: Kemet; Copyright: Copyright (C) 2023 Ultra Librarian. All rights reserved.; Manufacturer_Part_Number: C0805C105K3RACAUTO; RefDes: RefDes; Type: DEV
CENMCU CENS CENS1 CIO3 CUSB1 SDVC = KGM21NR71H104JT: No Description Available; Mfr_Name: KYOCERA AVX; Type: DEV; Copyright: Copyright (C) 2023 Ultra Librarian. All rights reserved.; Manufacturer_Part_Number: KGM21NR71H104JT; RefDes: RefDes
CIN CIN1-CIN5 CUSB2 = C0805C475M4RACAUTO: Package: None; Price: None; Value: *; MP: C0805C475M4RACAUTO; Availability: Unavailable
CSS CSS1 = CC0805KRX7R8BB823: No Description Available; Mfr_Name: Yageo; Copyright: Copyright (C) 2023 Ultra Librarian. All rights reserved.; Manufacturer_Part_Number: CC0805KRX7R8BB823; RefDes: RefDes; Type: DEV
CVCC CVCC1 = C0805C225K3RAC7800: No Description Available; Mfr_Name: Kemet; Copyright: Copyright (C) 2023 Ultra Librarian. All rights reserved.; Manufacturer_Part_Number: C0805C225K3RAC7800; RefDes: RefDes; Type: DEV
D1 D5 D13 = 1N5819HW-7-F: 1N5819HW Series 40 V 1 A Surface Mount Schottky Barrier Rectifier - SOD-123 Check availability; GateName_1: G$1; MF: Diodes Inc.; SymbolName_1: 1N5819HW-7-F; LibraryName: 1N5819HW-7-F; DeviceSetName: 1N5819HW-7-F; AVAILABILITY: In Stock; CHECK_PRICES: https://www.snapeda.com/parts/1N5819HW-7-F/Diodes+Inc./view-part/?ref=eda; MP: 1N5819HW-7-F; PACKAGE: SOD-123 Fairchild Semiconductor; PRICE: None; PURCHASE-URL: https://www.snapeda.com/api/url_track_click_mouser/?unipart_id=42272&manufacturer=Diodes Inc.&part_name=1N5819HW-7-F&search_term=1n5819hw-7-f; SNAPEDA_LINK: https://www.snapeda.com/parts/1N5819HW-7-F/Diodes+Inc./view-part/?ref=snap
D2-D4 D6-D8 D14-D16 = CPDQ5V0-HF: ESD Suppressors / TVS Diodes SMD ESD Diode 5V Bi-Direction   Source:  Datasheet   Check availability; GateName_1: G$1; MF: Comchip Technology; SymbolName_1: CPDQ5V0-HF; LibraryName: CPDQ5V0-HF; DeviceSetName: CPDQ5V0-HF; AVAILABILITY: In Stock; CHECK_PRICES: https://www.snapeda.com/parts/CPDQ5V0-HF/Comchip+Technology/view-part/?ref=eda; MP: CPDQ5V0-HF; PACKAGE: 0402 Comchip; PRICE: None; PURCHASE-URL: https://www.snapeda.com/api/url_track_click_mouser/?unipart_id=809934&manufacturer=Comchip Technology&part_name=CPDQ5V0-HF&search_term=cpdq5v0-hf; SNAPEDA_LINK: https://www.snapeda.com/parts/CPDQ5V0-HF/Comchip+Technology/view-part/?ref=snap
DA_CONVERTER_SD = CD74HC4050MT: Check availability; GateName_1: A; MF: Texas Instruments; SymbolName_1: CD74HC4050MT; LibraryName: CD74HC4050MT; DeviceSetName: CD74HC4050MT; AVAILABILITY: In Stock; CHECK_PRICES: https://www.snapeda.com/parts/CD74HC4050MT/Texas+Instruments/view-part/?ref=eda; MP: CD74HC4050MT; PACKAGE: SOIC-16 Texas Instruments; PRICE: None; PURCHASE-URL: https://www.snapeda.com/api/url_track_click_mouser/?unipart_id=1170164&manufacturer=Texas Instruments&part_name=CD74HC4050MT&search_term=cd74hc4050; SNAPEDA_LINK: https://www.snapeda.com/parts/CD74HC4050MT/Texas+Instruments/view-part/?ref=snap
F1 = PTS18126V300: No Description Available; Mfr_Name: Eaton; Type: DEV; Copyright: Copyright (C) 2023 Ultra Librarian. All rights reserved.; Manufacturer_Part_Number: PTS18126V300; RefDes: RefDes
I2C_TEST PWR_PO = PPTC041LFBN-RC: 4 Position Header Connector Through Hole  Check availability; GateName_1: G$1; MF: Sullins Connector; SymbolName_1: PPTC041LFBN-RC; LibraryName: PPTC041LFBN-RC; DeviceSetName: PPTC041LFBN-RC; AVAILABILITY: In Stock; CHECK_PRICES: https://www.snapeda.com/parts/PPTC041LFBN-RC/Sullins+Connector+Solutions/view-part/?ref=eda; MP: PPTC041LFBN-RC; PACKAGE: None; PRICE: None; PURCHASE-URL: https://www.snapeda.com/api/url_track_click_mouser/?unipart_id=285917&manufacturer=Sullins Connector&part_name=PPTC041LFBN-RC&search_term=pptc041lfbn-rc; SNAPEDA_LINK: https://www.snapeda.com/parts/PPTC041LFBN-RC/Sullins+Connector+Solutions/view-part/?ref=snap
I2C_USBC_IN STEPPER_USBC_IN UART_USBC_IN = USB4110-GF-A: MFR_NAME: Global Connector Technology; GateName_1: A; SymbolName_1: USB4110-GF-A; LibraryName: USB4110-GF-A; DeviceSetName: USB4110-GF-A; COPYRIGHT: Copyright (C) 2023 Ultra Librarian. All rights reserved.; MANUFACTURER_PART_NUMBER: USB4110-GF-A
L1 = 680nH: HPPC10040-R68M-Q8; Manufacturer: chilisin(奇力新); Contributor: LCSC; nameAlias: Value; Supplier: LCSC; Supplier Part: C910026; Manufacturer Part: HPPC10040-R68M-Q8; JLCPCB Part Class: Extended Part; spicePre: L; spiceSymbolName: HPPC10040-R68M-Q8
L2 = 1uH: FXC1265-1R0M; Manufacturer: cjiang(长江微电); nameAlias: Value; Contributor: LCSC; Supplier: LCSC; Supplier Part: C208109; Manufacturer Part: FXC1265-1R0M; JLCPCB Part Class: Extended Part; spicePre: L; spiceSymbolName: FXC1265-1R0M
MCU = ESP32-C6-WROOM-1-N8: MFR_NAME: Espressif Systems; GateName_1: A; SymbolName_1: ESP32-C6-WROOM-1(U); LibraryName: ESP32-C6-WROOM-1U; DeviceSetName: ESP32-C6-WROOM-1-N8; COPYRIGHT: Copyright (C) 2023 Ultra Librarian. All rights reserved.; MANUFACTURER_PART_NUMBER: ESP32-C6-WROOM-1-N8; TYPE: RF
OP_AMP_LEDS = LM358DR: Check availability; GateName_1: A; MF: Texas Instruments; SymbolName_1: LM358DR; LibraryName: LM358DR; DeviceSetName: LM358DR; AVAILABILITY: In Stock; CHECK_PRICES: https://www.snapeda.com/parts/LM358DR/Texas+Instruments/view-part/?ref=eda; MP: LM358DR; PACKAGE: SOIC-8 Texas Instruments; PRICE: None; PURCHASE-URL: https://www.snapeda.com/api/url_track_click_mouser/?unipart_id=6639&manufacturer=Texas Instruments&part_name=LM358DR&search_term=lm358dr; SNAPEDA_LINK: https://www.snapeda.com/parts/LM358DR/Texas+Instruments/view-part/?ref=snap
POUT1 POUT2 = PPTC111LFBN-RC: No Description Available; Mfr_Name: Sullins; Type: DEV; Copyright: Copyright (C) 2023 Ultra Librarian. All rights reserved.; Manufacturer_Part_Number: PPTC111LFBN-RC; RefDes: RefDes
Q1 Q2 = CMP-20235-000001-1: NPN TRANSISTOR 1.5A 40V SOT-23 R; Transition Frequency: 100MHz; Max Breakdown Voltage: 25V; Collector Emitter Voltage (VCEO): 400mV; Max Power Dissipation: 300mW; Max Collector Current: 1.5A; Case/Package: TO-236-3; Packaging: Tape and Reel; RoHS Compliant: Yes; Mount: Surface Mount; Collector Emitter Breakdown Voltage: 25V
RENB RENB1 RENMCU RFAULT2-RFAULT4 RFBB RFBB1 RIO3_PD RIO8_UP RLEDOUT RLEDOUT1-RLEDOUT3 RU1 RU5 RU6 = TNPW080510K0FEEA: Package: None; Price: None; Value: *; MP: TNPW080510K0FEEA; Availability: Unavailable
RENT RENT1 = RC0805FR-0766K5L: 66.5 kOhms Â±1% 0.125W, 1/8W Chip Resistor 0805 (2012 Metric) Moisture Resistant Thick Film; MF: Yageo; SnapEDA_Link: https://www.snapeda.com/parts/RC0805FR-0766K5L/Yageo/view-part/?ref=snap; Package: 2012 Yageo; Value: *; MP: RC0805FR-0766K5L; Check_prices: https://www.snapeda.com/parts/RC0805FR-0766K5L/Yageo/view-part/?ref=eda
RFBT = CRCW080526K7FKEA: RES, THICK FILM, 26K7, 1%, 0.125W, 0805, REEL; Package: None; Price: None; Value: *; MP: CRCW080526K7FKEA; Availability: Unavailable
RFBT1 = CRCW080545K3FKEA: D12/Crcw0805 100 45K3 1% Et1 E3; Package: None; Price: None; Value: *; MP: CRCW080545K3FKEA; Availability: Unavailable
RILIM RILIM1 RILIM2 = CRCW080520K0FKTA: Res Thick Film 0805 20K Ohm 1% 0.125W(1/8W) Â±100ppm/C Molded SMD Automotive Paper T/R; Package: None; Price: None; Value: *; MP: CRCW080520K0FKTA; Availability: Unavailable
RLEDOUT8 RLEDOUT9 = AC0805FR-072K2L: Fixed Resistor, Metal Glaze/thick Film, 0.125W, 2200ohm, 150V, 1% +/-Tol, 100ppm/Cel, Surface Mount, 0805; Package: None; Price: None; Value: *; MP: AC0805FR-072K2L; Availability: Unavailable
RMODE RMODE1 RPG RPG1 = CRCW080530K1FKEA: RESISTOR, 0805, 30K1, 1%, FULL REEL; Package: None; Price: None; Value: *; MP: CRCW080530K1FKEA; Availability: Unavailable
RSDCS RU2 = CRCW08051K00JNEA: No Description Available; Mfr_Name: Vishay; Copyright: Copyright (C) 2023 Ultra Librarian. All rights reserved.; Manufacturer_Part_Number: CRCW08051K00JNEA; RefDes: RefDes; Type: DEV
RTRIP = CRCW08056K98FKEA: Res Thick Film 0805 6.98K Ohm 1% 1/8W Â±100ppm/Â°C Molded SMD SMD Paper T/R; Package: None; Price: None; Value: *; MP: CRCW08056K98FKEA; Availability: Unavailable
RTRIP1 = WK73R2ATTD1212F: Package: None; Price: None; Value: *; MP: WK73R2ATTD1212F; Availability: Unavailable
RU3 = CRCW080547K5FKEA: 47.5 kOhms Â±1% 0.125W, 1/8W Chip Resistor 0805 (2012 Metric) Automotive AEC-Q200 Thick Film; MF: Vishay Dale; Price: None; Availability: Warning; Package: 2012 Vishay; MP: CRCW080547K5FKEA; Value: *; SnapEDA_Link: https://www.snapeda.com/parts/CRCW080547K5FKEA/Vishay%20Dale/view-part/53458/?ref=snap; Check_prices: https://www.snapeda.com/parts/CRCW080547K5FKEA/Vishay%20Dale/view-part/53458/?ref=eda; Purchase-URL: https://pricing.snapeda.com/search/part/CRCW080547K5FKEA/?ref=eda
RU4 = CR0805-FX-2212ELF: 22.1 kOhms Â±1% 0.125W, 1/8W Chip Resistor 0805 (2012 Metric) Moisture Resistant Thick Film; MF: Bourns; SnapEDA_Link: https://www.snapeda.com/parts/CR0805-FX-2212ELF/Bourns/view-part/?ref=snap; Package: 0805 Bourns; Value: *; MP: CR0805-FX-2212ELF; Check_prices: https://www.snapeda.com/parts/CR0805-FX-2212ELF/Bourns/view-part/?ref=eda
RUSB RUSB1-RUSB3 RUSB6 RUSB7 = RC0805JR-075K1L: RC0805 5,1K 5% 0,125W; Package: None; Price: None; Value: *; MP: RC0805JR-075K1L; Availability: Unavailable
SD_CONNECTOR = 1660: No Description Available; Mfr_Name: Adafruit Industries; Copyright: Copyright (C) 2023 Ultra Librarian. All rights reserved.; Manufacturer_Part_Number: 1660; RefDes: RefDes; Type: DEV
SENSOR_PSWITCH SERVO_PSWITCH STEPPER_P_SWITCH = AP22653W6-7: Power Switch/Driver 1:1 P-Channel 2.1A SOT-23-6  Check availability; GateName_1: G$1; MF: Diodes Incorporated; SymbolName_1: AP22653W6-7; LibraryName: AP22653W6-7; DeviceSetName: AP22653W6-7; AVAILABILITY: In Stock; CHECK_PRICES: https://www.snapeda.com/parts/AP22653W6-7/Diodes+Inc./view-part/?ref=eda; MP: AP22653W6-7; PACKAGE: SOT-23-6 Diodes Incorporated; PRICE: None; PURCHASE-URL: https://www.snapeda.com/api/url_track_click_mouser/?unipart_id=4792807&manufacturer=Diodes Incorporated&part_name=AP22653W6-7&search_term=ap22653w6-7; SNAPEDA_LINK: https://www.snapeda.com/parts/AP22653W6-7/Diodes+Inc./view-part/?ref=snap
SENSOR_USBA_IN = USB-A-S-RA-SMT: Connector; Manufacturer_Name: Adam Tech; Datasheet Link: https://app.adam-tech.com/products/download/data_sheet/195864/usb-a-s-ra-smt-data-sheet.pdf; Height: 7.493mm; Manufacturer_Part_Number: USB-A-S-RA-SMT; Arrow Part Number: USB-A-S-RA-SMT; Arrow Price/Stock: https://www.arrow.com/en/products/usb-a-s-ra-smt/adam-tech?region=nac
SW-BOOT = JS102011SCQN: Switch; Manufacturer_Name: C & K COMPONENTS; Datasheet Link: https://www.ckswitches.com/media/1422/js.pdf; Height: 5mm; Manufacturer_Part_Number: JS102011SCQN; Mouser Part Number: 611-JS102011SCQN; Mouser Price/Stock: https://www.mouser.co.uk/ProductDetail/CK/JS102011SCQN?qs=aIxPIZZxLh%2FC%2Fw7UJtfwsg%3D%3D; Arrow Part Number: JS102011SCQN; Arrow Price/Stock: https://www.arrow.com/en/products/js102011scqn/ck?region=nac
SW_IO3_PD SW_RESET = 1825910-6: Switch Tactile OFF (ON) SPST Round Button PC Pins 0.05A 24VDC 100000Cycles 1.57N Thru-Hole Loose Check availability; GateName_1: G$1; MF: TE Connectivity; SymbolName_1: 1825910-6; LibraryName: 1825910-6; DeviceSetName: 1825910-6; AVAILABILITY: In Stock; CHECK_PRICES: https://www.snapeda.com/parts/1825910-6/TE+Connectivity+ALCOSWITCH+Switches/view-part/?ref=eda; MP: 1825910-6; PACKAGE: None; PRICE: None; PURCHASE-URL: https://www.snapeda.com/api/url_track_click_mouser/?unipart_id=226996&manufacturer=TE Connectivity&part_name=1825910-6&search_term=1825910-6; SNAPEDA_LINK: https://www.snapeda.com/parts/1825910-6/TE+Connectivity+ALCOSWITCH+Switches/view-part/?ref=snap
U14 = MMSZ5225BT1G: MFR_NAME: onsemi; GateName_1: A; SymbolName_1: MMSZ5225BT1G; LibraryName: MMSZ5225BT1G; DeviceSetName: MMSZ5225BT1G; COPYRIGHT: Copyright (C) 2023 Ultra Librarian. All rights reserved.; MANUFACTURER_PART_NUMBER: MMSZ5225BT1G
U15 = MMSZ5230BT1G: MFR_NAME: onsemi; GateName_1: A; SymbolName_1: MMSZ5230BT1G; LibraryName: MMSZ5230BT1G; DeviceSetName: MMSZ5230BT1G; COPYRIGHT: Copyright (C) 2023 Ultra Librarian. All rights reserved.; MANUFACTURER_PART_NUMBER: MMSZ5230BT1G
UART_USB_CONVERTER = CP2102N-A02-GQFN28: Check availability; GateName_1: G$1; MF: Silicon Labs; SymbolName_1: CP2102N-A02-GQFN28; LibraryName: CP2102N-A02-GQFN28; DeviceSetName: CP2102N-A02-GQFN28; AVAILABILITY: In Stock; CHECK_PRICES: https://www.snapeda.com/parts/CP2102N-A02-GQFN28/Silicon+Labs/view-part/?ref=eda; MP: CP2102N-A02-GQFN28; PACKAGE: WFQFN-28 Silicon Labs; PRICE: None; PURCHASE-URL: https://www.snapeda.com/api/url_track_click_mouser/?unipart_id=4872321&manufacturer=Silicon Labs&part_name=CP2102N-A02-GQFN28&search_term=cp2102n-a02-gqfn28; SNAPEDA_LINK: https://www.snapeda.com/parts/CP2102N-A02-GQFN28/Silicon+Labs/view-part/?ref=snap